# Altium schematic sheet 05_LCD_LVDS.SchDoc: =GlobalProjectName
size 594 x 420 mm; ApprovedBy: Галкин; CheckedBy: Галкин; Author: Данич; SheetNumber: 5; SheetTotal: 8; PageSetup: Record=PageOptions|CenterHorizontal=True|CenterVertical=True|PrintScale=0.70|XCorrection=1.00|YCorrection=1.00|PrintKind=2|BorderSize=5000000|LeftOffset=9000|BottomOffset=10100|Orientation=2|PaperLength=11176|PaperWidth=8636|Scale=100|PaperSource=259|PrintQuality=-3|MediaType=1|DitherType=10|PrintScaleMode=1|PaperKind=A3|PaperIndex=8
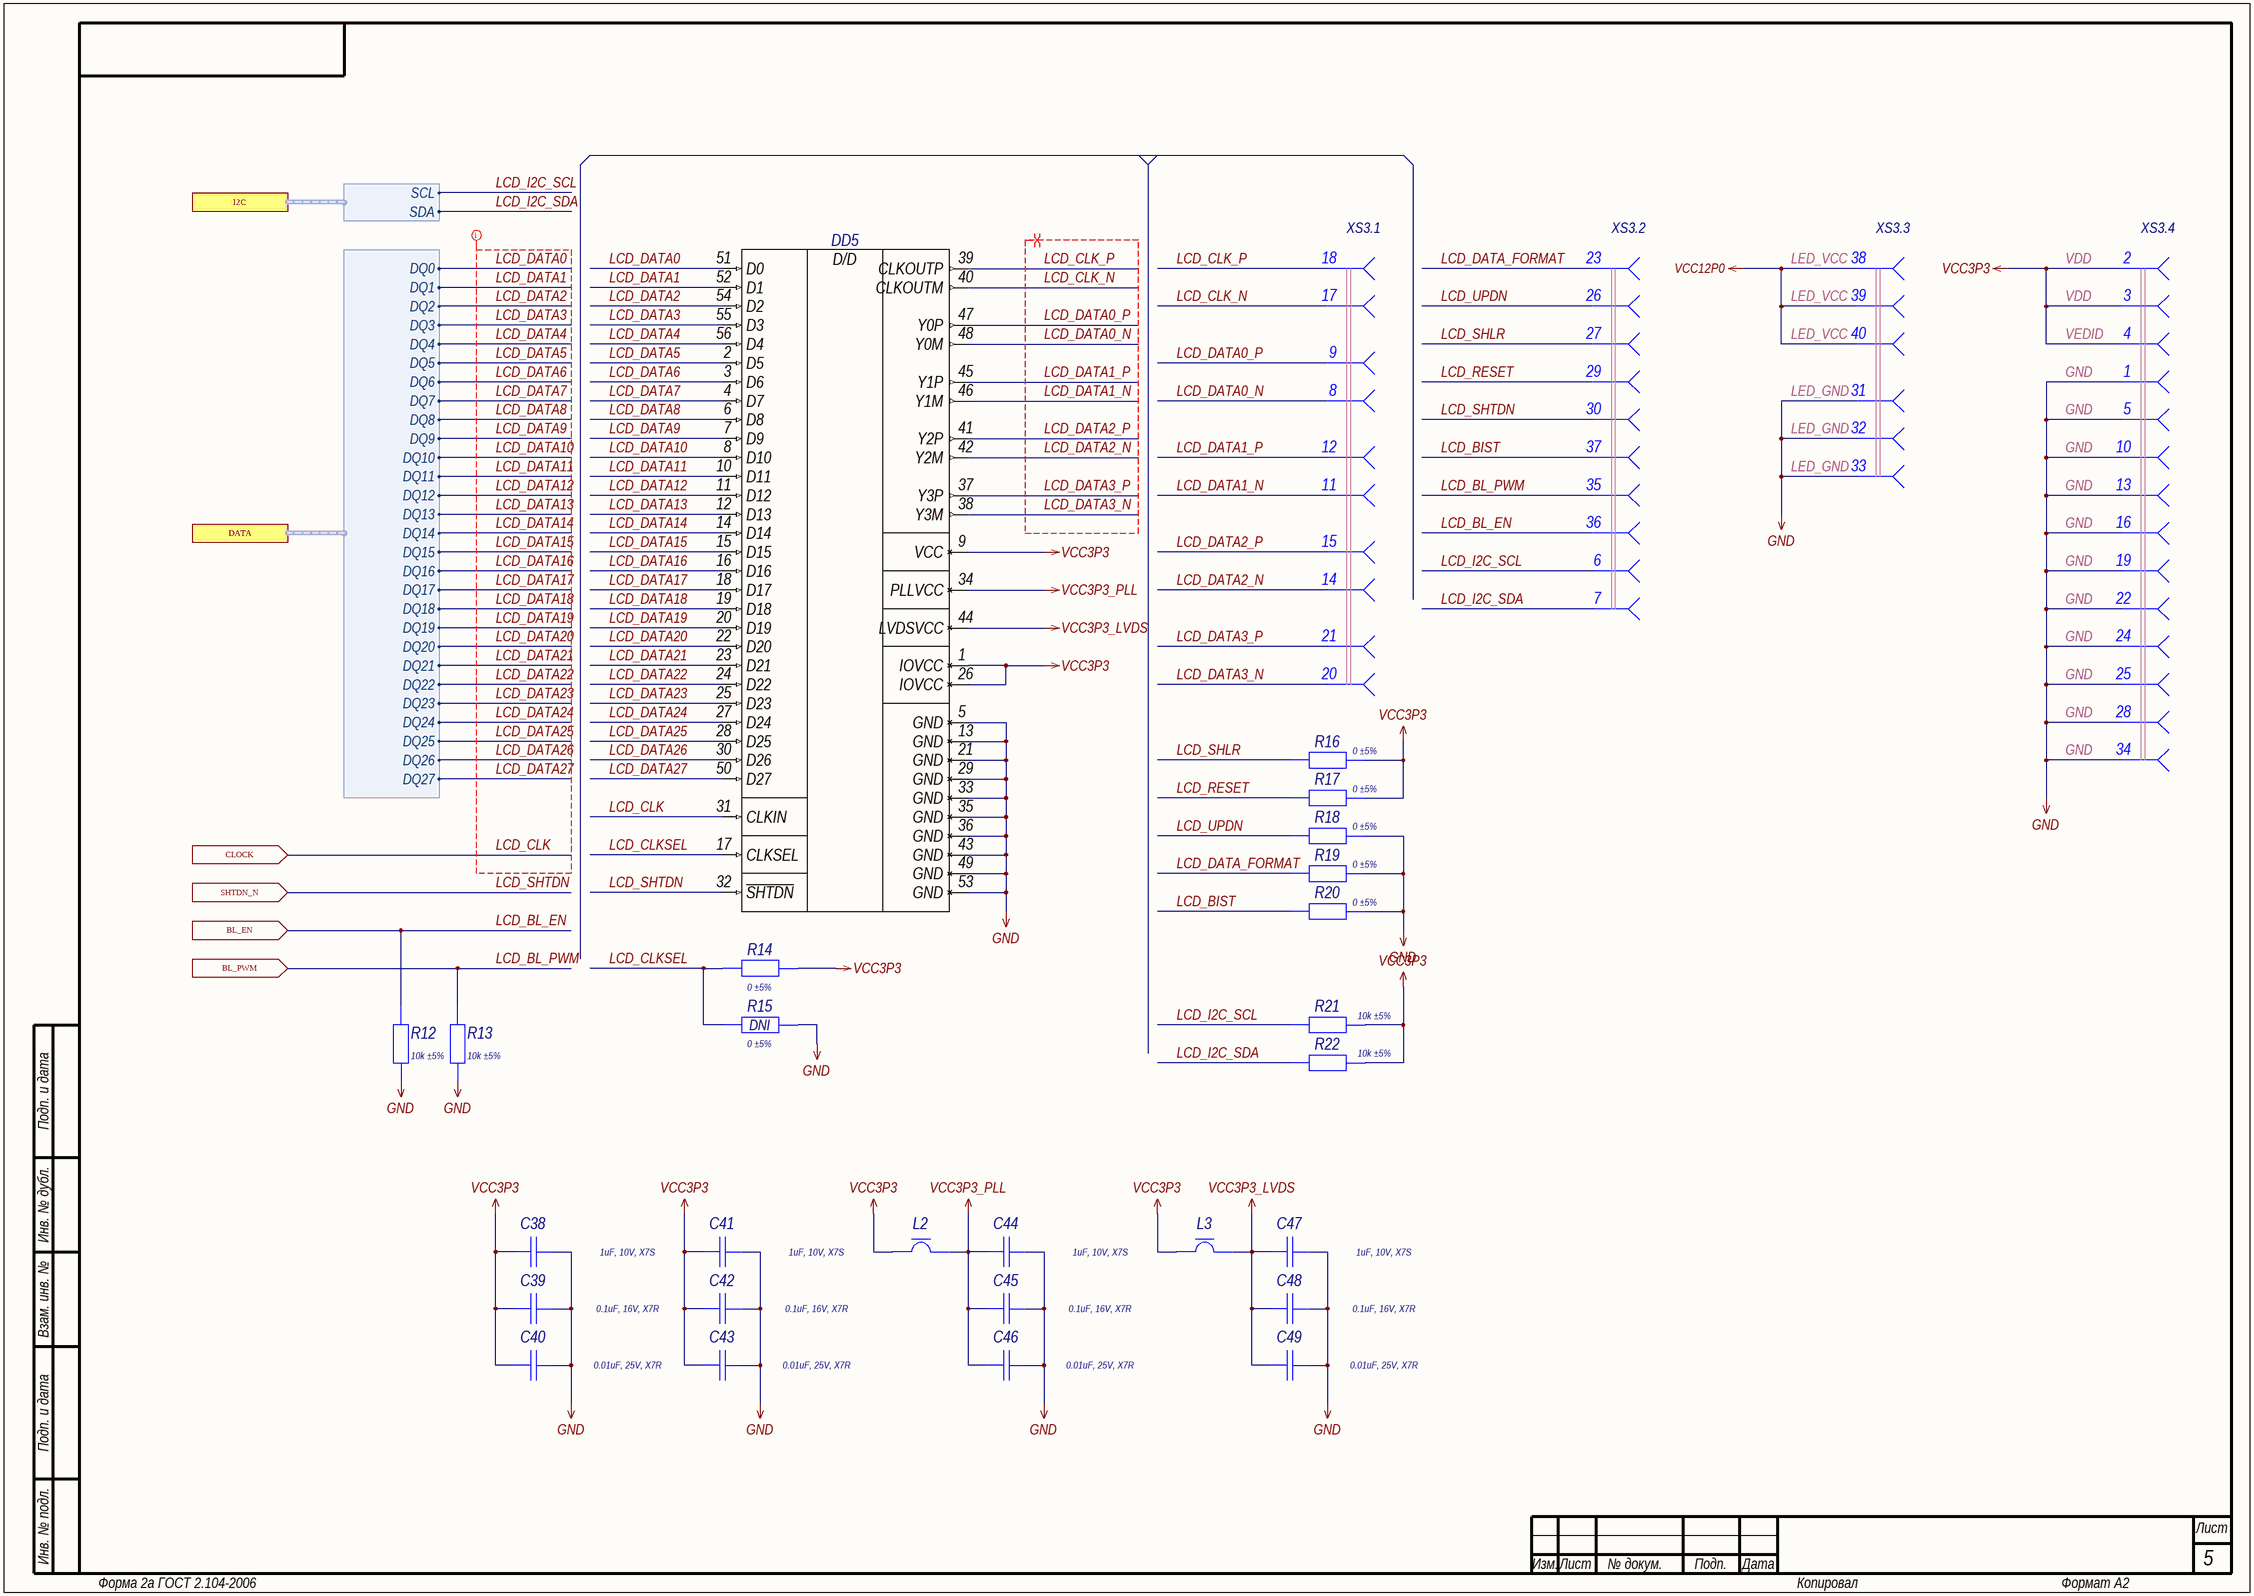
[diagram p0: 05_LCD_LVDS.SchDoc]

## Parts
C38  Schematic Value: 1uF, 10V, X7S  [C0402_L]  (hidden comment: Capacitor)
C39  Schematic Value: 0.1uF, 16V, X7R  [C0402_L]  (hidden comment: Capacitor)
C40  Schematic Value: 0.01uF, 25V, X7R  [C0402_L]  (hidden comment: Capacitor)
C41  Schematic Value: 1uF, 10V, X7S  [C0402_L]  (hidden comment: Capacitor)
C42  Schematic Value: 0.1uF, 16V, X7R  [C0402_L]  (hidden comment: Capacitor)
C43  Schematic Value: 0.01uF, 25V, X7R  [C0402_L]  (hidden comment: Capacitor)
C44  Schematic Value: 1uF, 10V, X7S  [C0402_L]  (hidden comment: Capacitor)
C45  Schematic Value: 0.1uF, 16V, X7R  [C0402_L]  (hidden comment: Capacitor)
C46  Schematic Value: 0.01uF, 25V, X7R  [C0402_L]  (hidden comment: Capacitor)
C47  Schematic Value: 1uF, 10V, X7S  [C0402_L]  (hidden comment: Capacitor)
C48  Schematic Value: 0.1uF, 16V, X7R  [C0402_L]  (hidden comment: Capacitor)
C49  Schematic Value: 0.01uF, 25V, X7R  [C0402_L]  (hidden comment: Capacitor)
DD5  SN65LVDS93ADGG  [TSSOP-56_050P1400X610X120_N]  (value not drawn)
L2  FerriteBead  [L0402_L]  (value not drawn)
L3  FerriteBead  [L0402_L]  (value not drawn)
R12  Schematic Value: 10k ±5%  [R0402_L]  (hidden comment: Resistor)
R13  Schematic Value: 10k ±5%  [R0402_L]  (hidden comment: Resistor)
R14  Schematic Value: 0 ±5%  [R0402_L]  (hidden comment: Resistor)
R15  Schematic Value: 0 ±5%  [R0402_L]  (hidden comment: Resistor)  (no BOM)
R16  Schematic Value: 0 ±5%  [R0402_L]  (hidden comment: Resistor)
R17  Schematic Value: 0 ±5%  [R0402_L]  (hidden comment: Resistor)
R18  Schematic Value: 0 ±5%  [R0402_L]  (hidden comment: Resistor)
R19  Schematic Value: 0 ±5%  [R0402_L]  (hidden comment: Resistor)
R20  Schematic Value: 0 ±5%  [R0402_L]  (hidden comment: Resistor)
R21  Schematic Value: 10k ±5%  [R0402_L]  (hidden comment: Resistor)
R22  Schematic Value: 10k ±5%  [R0402_L]  (hidden comment: Resistor)
XS3  TFT LVDS  [54104-4031]  (value not drawn)  (parts A,B,C,D,E,F,G,H,I,J,K,L,M,N,O,P,Q,R,S,T,U,V,W,X,Y,Z,27,28,29,30,31,32,33,34,35,36,37,38,39,40 of 40)

## Ports
BL_EN (in), BL_PWM (in), CLOCK (in), DATA (harness LCD_DQ), I2C (harness I2C), SHTDN_N (in)

## Harnesses
LCD_DQ: DQ0, DQ1, DQ2, DQ3, DQ4, DQ5, DQ6, DQ7, DQ8, DQ9, DQ10, DQ11, DQ12, DQ13, DQ14, DQ15, DQ16, DQ17, DQ18, DQ19, DQ20, DQ21, DQ22, DQ23, DQ24, DQ25, DQ26, DQ27
I2C: SCL, SDA

## Nets
GND: C38.2 C39.2 C40.2 C41.2 C42.2 C43.2 C44.2 C45.2 C46.2 C47.2 C48.2 C49.2 DD5.5(GND) DD5.13(GND) DD5.21(GND) DD5.29(GND) DD5.33(GND) DD5.35(GND) DD5.36(GND) DD5.43(GND) DD5.49(GND) DD5.53(GND) R12.1 R13.1 R15.2 R18.2 R19.2 R20.2 XS3.1 XS3.5 XS3.10 XS3.13 XS3.16 XS3.19 XS3.22 XS3.24 XS3.25 XS3.28 XS3.31 XS3.32 XS3.33 XS3.34
VCC3P3: C38.1 C39.1 C40.1 C41.1 C42.1 C43.1 DD5.1(IOVCC) DD5.9(VCC) DD5.26(IOVCC) L2.1 L3.1 R14.2 R16.2 R17.2 R21.1 R22.1 XS3.2 XS3.3 XS3.4
VCC3P3_LVDS: C47.1 C48.1 C49.1 DD5.44(LVDSVCC) L3.2
VCC3P3_PLL: C44.1 C45.1 C46.1 DD5.34(PLLVCC) L2.2
VCC12P0: XS3.38 XS3.39 XS3.40
LCD_BIST: R20.1 XS3.37
LCD_BL_EN: R12.2 XS3.36 ; port BL_EN
LCD_BL_PWM: R13.2 XS3.35 ; port BL_PWM
LCD_CLK: DD5.31(CLKIN) ; port CLOCK
LCD_CLK_N: DD5.40(CLKOUTM) XS3.17
LCD_CLK_P: DD5.39(CLKOUTP) XS3.18
LCD_CLKSEL: DD5.17(CLKSEL) R14.1 R15.1
LCD_DATA0: DD5.51(D0) ; port DATA.DQ0
LCD_DATA0_N: DD5.48(Y0M) XS3.8
LCD_DATA0_P: DD5.47(Y0P) XS3.9
LCD_DATA1: DD5.52(D1) ; port DATA.DQ1
LCD_DATA1_N: DD5.46(Y1M) XS3.11
LCD_DATA1_P: DD5.45(Y1P) XS3.12
LCD_DATA2: DD5.54(D2) ; port DATA.DQ2
LCD_DATA2_N: DD5.42(Y2M) XS3.14
LCD_DATA2_P: DD5.41(Y2P) XS3.15
LCD_DATA3: DD5.55(D3) ; port DATA.DQ3
LCD_DATA3_N: DD5.38(Y3M) XS3.20
LCD_DATA3_P: DD5.37(Y3P) XS3.21
LCD_DATA4: DD5.56(D4) ; port DATA.DQ4
LCD_DATA5: DD5.2(D5) ; port DATA.DQ5
LCD_DATA6: DD5.3(D6) ; port DATA.DQ6
LCD_DATA7: DD5.4(D7) ; port DATA.DQ7
LCD_DATA8: DD5.6(D8) ; port DATA.DQ8
LCD_DATA9: DD5.7(D9) ; port DATA.DQ9
LCD_DATA10: DD5.8(D10) ; port DATA.DQ10
LCD_DATA11: DD5.10(D11) ; port DATA.DQ11
LCD_DATA12: DD5.11(D12) ; port DATA.DQ12
LCD_DATA13: DD5.12(D13) ; port DATA.DQ13
LCD_DATA14: DD5.14(D14) ; port DATA.DQ14
LCD_DATA15: DD5.15(D15) ; port DATA.DQ15
LCD_DATA16: DD5.16(D16) ; port DATA.DQ16
LCD_DATA17: DD5.18(D17) ; port DATA.DQ17
LCD_DATA18: DD5.19(D18) ; port DATA.DQ18
LCD_DATA19: DD5.20(D19) ; port DATA.DQ19
LCD_DATA20: DD5.22(D20) ; port DATA.DQ20
LCD_DATA21: DD5.23(D21) ; port DATA.DQ21
LCD_DATA22: DD5.24(D22) ; port DATA.DQ22
LCD_DATA23: DD5.25(D23) ; port DATA.DQ23
LCD_DATA24: DD5.27(D24) ; port DATA.DQ24
LCD_DATA25: DD5.28(D25) ; port DATA.DQ25
LCD_DATA26: DD5.30(D26) ; port DATA.DQ26
LCD_DATA27: DD5.50(D27) ; port DATA.DQ27
LCD_DATA_FORMAT: R19.1 XS3.23
LCD_I2C_SCL: R21.2 XS3.6 ; port I2C.SCL
LCD_I2C_SDA: R22.2 XS3.7 ; port I2C.SDA
LCD_RESET: R17.1 XS3.29
LCD_SHLR: R16.1 XS3.27
LCD_SHTDN: DD5.32(~{SHTDN}) XS3.30 ; port SHTDN_N
LCD_UPDN: R18.1 XS3.26

## Layout directives
differential pair; differential pair class LCD_LVDS: LCD_CLK_N, LCD_CLK_P, LCD_DATA0_N, LCD_DATA0_P, LCD_DATA1_N, LCD_DATA1_P, LCD_DATA2_N, LCD_DATA2_P, LCD_DATA3_N, LCD_DATA3_P
net class LCD: LCD_CLK, LCD_DATA0, LCD_DATA1, LCD_DATA2, LCD_DATA3, LCD_DATA4, LCD_DATA5, LCD_DATA6, LCD_DATA7, LCD_DATA8, LCD_DATA9, LCD_DATA10, LCD_DATA11, LCD_DATA12, LCD_DATA13, LCD_DATA14, LCD_DATA15, LCD_DATA16, LCD_DATA17, LCD_DATA18, LCD_DATA19, LCD_DATA20, LCD_DATA21, LCD_DATA22, LCD_DATA23, LCD_DATA24, LCD_DATA25, LCD_DATA26, LCD_DATA27

## Notes on the sheet
- (near XS3) XS3.1
- (near XS3) XS3.2
- (near XS3) LED_VCC
- (near XS3) XS3.3
- VDD
- (near XS3) XS3.4
- (near XS3) VEDID
- (near XS3) LED_GND
- GND
- (near R15) DNI
- Подп. и дата
- Инв. № дубл.
- Взам. инв. №
- Инв. № подл.
- Изм.
- Лист
- № докум.
- Подп.
- Дата
- Форма 2а ГОСТ 2.104-2006
- Копировал
- Формат А2
- (in symbol SN65LVDS93ADGGR) D/D

## Library data of the parts
C38 C41 C44 C47 = GRM155C71A105KE11D: Manufacturer: Murata; Type: Конденсатор; ID: 179; Value: 1uF; Voltage: 10V; Tolerance: ±10%; Dielectric Type: X7S; Application Category: 1; Working Temperature Min: -55°С; Working Temperature Max: +125°С; Published: 18.05.2010; Publisher: Andrew Danich; Part Number: GRM155C71A105KE11D; Footprint: 0402
C39 C42 C45 C48 = GCM155R71C104KA55D: Manufacturer: Murata; Type: Конденсатор; ID: 163; Value: 0.1uF; Voltage: 16V; Tolerance: ±10%; Dielectric Type: X7R; Application Category: 1; Working Temperature Min: -55°С; Working Temperature Max: +125°С; Functional Analog: GRM155R71C104KA88D; Published: 18.05.2010; Publisher: Andrew Danich; Part Number: GCM155R71C104KA55D; Footprint: 0402
C40 C43 C46 C49 = GCM155R71E103KA37D: Manufacturer: Murata; Type: Конденсатор; ID: 150; Value: 0.01uF; Voltage: 25V; Tolerance: ±10%; Dielectric Type: X7R; Application Category: 1; Working Temperature Min: -55°С; Working Temperature Max: +125°С; Functional Analog: GRM155R71E103KA01D; Published: 18.05.2010; Publisher: Andrew Danich; Part Number: GCM155R71E103KA37D; Footprint: 0402
DD5 = SN65LVDS93ADGGR: Manufacturer: Texas Instruments; ID: 4; Supply Operation: +1.62…3.6V; Supply Current: 102mA; Number of Receivers: 28; Input Type: LVTTL; Output Type: LVDS; Data Rate: 3780 Mb/s; Application Category: 1; Working Temperature Min: -40°С; Working Temperature Max: +85°С; Published: 19.05.2020; Publisher: Andrew Danich; Type: Микросхема; Part Number: SN65LVDS93ADGGR; Value: SN65LVDS93ADGGR; Number of Drivers: 4; Functional Analog: SN65LVDS93ADGG
L2 L3 = BLM15PD121SN1D: Manufacturer: Murata; Type: Дроссель; ID: 11; Rated Current: 1.3A; Impedance at 100Mhz: 120ohm; Tolerance: ±25%; DC Resistance: 0.09ohm; Inductor Type: EMIFIL; Application Category: 1; Working Temperature Min: -55°С; Working Temperature Max: +125°С; Published: 14.11.2014; Publisher: Andrew Danich; Part Number: BLM15PD121SN1D; Value: BLM15PD121SN1D; Footprint: 0402
R12 R13 R21 R22 = RC0402JR-0710KL: Manufacturer: Yageo; ID: 476; Value: 10k; Limit Voltage: 50V; Tolerance: ±5%; Temperature Coefficient: 100ppm; Total Power Dissipation: 0.1W; Series Type: Thick-Film; Application Category: 1; Working Temperature Min: -55°С; Working Temperature Max: +155°С; Published: 24.03.2010; Publisher: Andrew Danich; Type: Резистор; Part Number: RC0402JR-0710KL; Footprint: 0402
R14-R20 = RC0402JR-070RL: Manufacturer: Yageo; ID: 362; Value: 0; Limit Voltage: 50V; Tolerance: ±5%; Temperature Coefficient: 100ppm; Total Power Dissipation: 0.1W; Series Type: Thick-Film; Application Category: 1; Working Temperature Min: -55°С; Working Temperature Max: +155°С; Published: 24.03.2010; Publisher: Andrew Danich; Type: Резистор; Part Number: RC0402JR-070RL; Footprint: 0402
XS3 = 54104-4031: Manufacturer: Molex; ID: 13; Limit Voltage: 50V; Limit Current: 500mA; Connector Type: Female; Pitch: 0.5mm; Application Category: 1; Working Temperature Min: -20°С; Working Temperature Max: +85°С; Published: 17.03.2018; Publisher: Andrew Danich; Type: Розетка; Part Number: 54104-4031; Value: 54104-4031; Pins: 40; Series: FFC\FPC